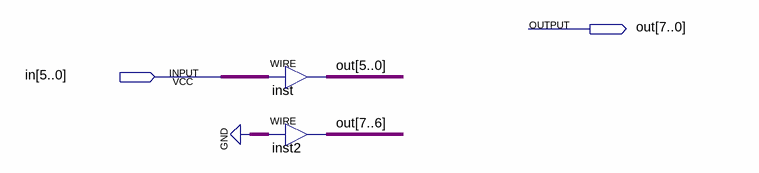
[diagram p0: schematic sheet]
// Quartus schematic zero_extend6to8.bdf as structural Verilog: 2 symbols, 2 pins
module zero_extend6to8 (
  input  [5:0] in,
  output [7:0] out
);

  assign out[5:0] = in;  // WIRE inst
  assign out[7:6] = 2'b00;  // WIRE inst2
endmodule
